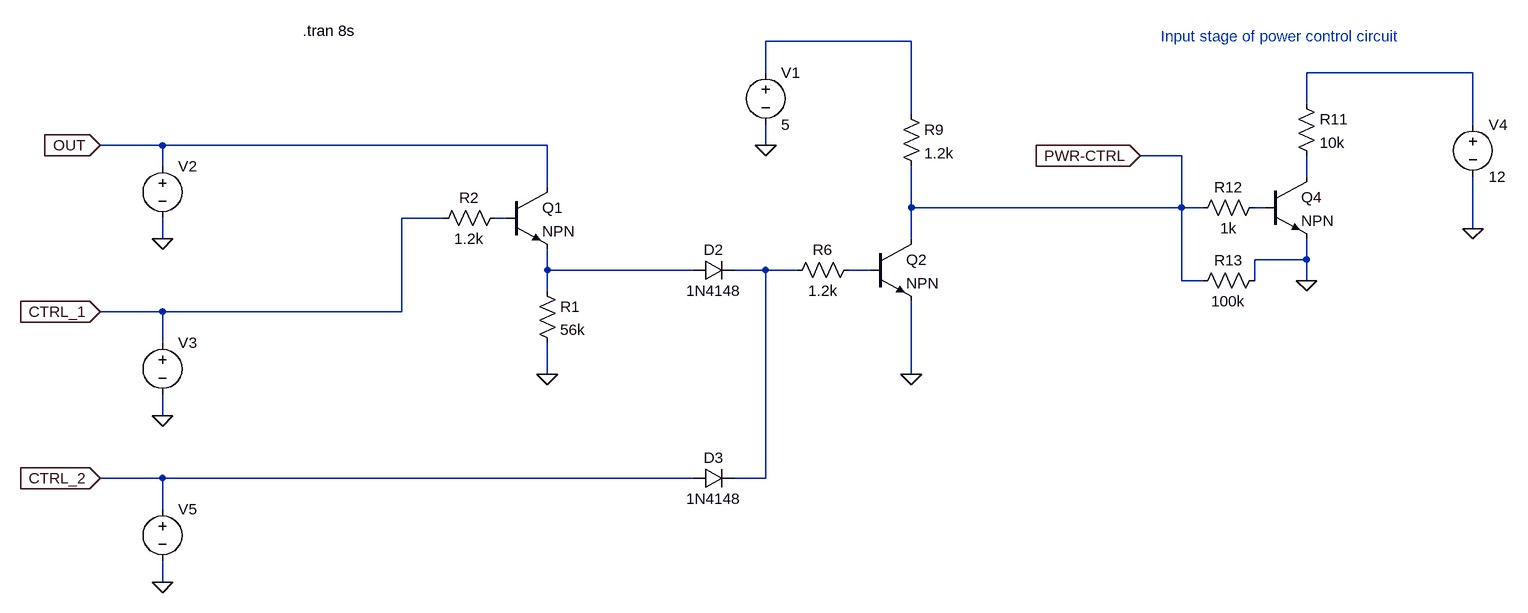
[diagram p0: schematic wdt_enable.asc]
wdt_enable.asc, the LTspice schematic file:
Version 4
SHEET 1 1340 1544
WIRE 272 480 48 480
WIRE 48 528 48 480
WIRE 1136 528 880 528
WIRE 880 576 880 528
WIRE 272 592 272 480
WIRE 1136 608 1136 528
WIRE -880 640 -976 640
WIRE -288 640 -880 640
WIRE 48 640 48 608
WIRE 688 656 624 656
WIRE -880 672 -880 640
WIRE 880 688 880 656
WIRE -288 704 -288 640
WIRE 272 736 272 672
WIRE 688 736 688 656
WIRE 688 736 272 736
WIRE 720 736 688 736
WIRE 816 736 800 736
WIRE -448 752 -512 752
WIRE -352 752 -368 752
WIRE 1136 768 1136 688
WIRE -880 784 -880 752
WIRE 272 784 272 736
WIRE 880 816 880 784
WIRE 880 816 800 816
WIRE -288 832 -288 800
WIRE -64 832 -288 832
WIRE 48 832 0 832
WIRE 96 832 48 832
WIRE 208 832 176 832
WIRE 688 848 688 736
WIRE 720 848 688 848
WIRE 800 848 800 816
WIRE 880 848 880 816
WIRE -288 864 -288 832
WIRE -880 896 -976 896
WIRE -512 896 -512 752
WIRE -512 896 -880 896
WIRE -880 944 -880 896
WIRE -288 992 -288 944
WIRE 272 992 272 880
WIRE -880 1056 -880 1024
WIRE -880 1152 -976 1152
WIRE -64 1152 -880 1152
WIRE 48 1152 48 832
WIRE 48 1152 0 1152
WIRE -880 1200 -880 1152
WIRE -880 1312 -880 1280
FLAG 48 640 0
FLAG -976 640 OUT
IOPIN -976 640 In
FLAG -976 896 CTRL_1
IOPIN -976 896 In
FLAG 272 992 0
FLAG 624 656 PWR-CTRL
IOPIN 624 656 In
FLAG 880 848 0
FLAG 1136 768 0
FLAG -288 992 0
FLAG -880 784 0
FLAG -880 1056 0
FLAG -880 1312 0
FLAG -976 1152 CTRL_2
IOPIN -976 1152 In
SYMBOL voltage 48 512 R0
WINDOW 123 0 0 Left 2
WINDOW 39 0 0 Left 2
SYMATTR InstName V1
SYMATTR Value 5
SYMBOL voltage -880 656 R0
WINDOW 3 24 44 Invisible 2
WINDOW 123 0 0 Left 2
WINDOW 39 0 0 Left 2
SYMATTR Value PWL(0 5 1 0 2 5 6 5 6.1 0)
SYMATTR InstName V2
SYMBOL npn 208 784 R0
SYMATTR InstName Q2
SYMBOL res 192 816 R90
WINDOW 0 0 56 VBottom 2
WINDOW 3 32 56 VTop 2
SYMATTR InstName R6
SYMATTR Value 1.2k
SYMBOL diode -64 848 R270
WINDOW 0 32 32 VTop 2
WINDOW 3 0 32 VBottom 2
SYMATTR InstName D2
SYMATTR Value 1N4148
SYMBOL diode -64 1168 R270
WINDOW 0 32 32 VTop 2
WINDOW 3 0 32 VBottom 2
SYMATTR InstName D3
SYMATTR Value 1N4148
SYMBOL res 256 576 R0
SYMATTR InstName R9
SYMATTR Value 1.2k
SYMBOL npn 816 688 R0
SYMATTR InstName Q4
SYMBOL res 864 560 R0
SYMATTR InstName R11
SYMATTR Value 10k
SYMBOL res 816 720 R90
WINDOW 0 0 56 VBottom 2
WINDOW 3 32 56 VTop 2
SYMATTR InstName R12
SYMATTR Value 1k
SYMBOL res 816 832 R90
WINDOW 0 0 56 VBottom 2
WINDOW 3 32 56 VTop 2
SYMATTR InstName R13
SYMATTR Value 100k
SYMBOL voltage 1136 592 R0
WINDOW 123 0 0 Left 2
WINDOW 39 0 0 Left 2
SYMATTR InstName V4
SYMATTR Value 12
SYMBOL npn -352 704 R0
SYMATTR InstName Q1
SYMBOL res -304 848 R0
SYMATTR InstName R1
SYMATTR Value 56k
SYMBOL res -352 736 R90
WINDOW 0 0 56 VBottom 2
WINDOW 3 32 56 VTop 2
SYMATTR InstName R2
SYMATTR Value 1.2k
SYMBOL voltage -880 928 R0
WINDOW 123 0 0 Left 2
WINDOW 39 0 0 Left 2
WINDOW 3 24 96 Invisible 2
SYMATTR InstName V3
SYMATTR Value PULSE(0 5 3 0 0 5 8 1)
SYMBOL voltage -880 1184 R0
WINDOW 123 0 0 Left 2
WINDOW 39 0 0 Left 2
WINDOW 3 24 96 Invisible 2
SYMATTR InstName V5
SYMATTR Value PULSE(0 5 0 0 0 3 5 1)
TEXT -664 464 Left 2 !.tran 8s
TEXT 656 472 Left 2 ;Input stage of power control circuit

The netlist it stands for:
* wdt_enable.asc
V1 N001 0 5
V2 OUT 0 PWL(0 5 1 0 2 5 6 5 6.1 0)
Q2 PWR-CTRL N008 0 0 NPN
R6 N008 N007 1.2k
D2 N006 N007 1N4148
D3 CTRL_2 N007 1N4148
R9 N001 PWR-CTRL 1.2k
Q4 N003 N004 0 0 NPN
R11 N002 N003 10k
R12 N004 PWR-CTRL 1k
R13 0 PWR-CTRL 100k
V4 N002 0 12
Q1 OUT N005 N006 0 NPN
R1 N006 0 56k
R2 N005 CTRL_1 1.2k
V3 CTRL_1 0 PULSE(0 5 3 0 0 5 8 1)
V5 CTRL_2 0 PULSE(0 5 0 0 0 3 5 1)
.model D D
.lib standard.dio
.model NPN NPN
.model PNP PNP
.lib standard.bjt
.tran 8s
* Input stage of power control circuit
.backanno
.end